# Altium schematic sheet SH05-DDS.SchDoc: ADM_PHASE_FPGA
size A4
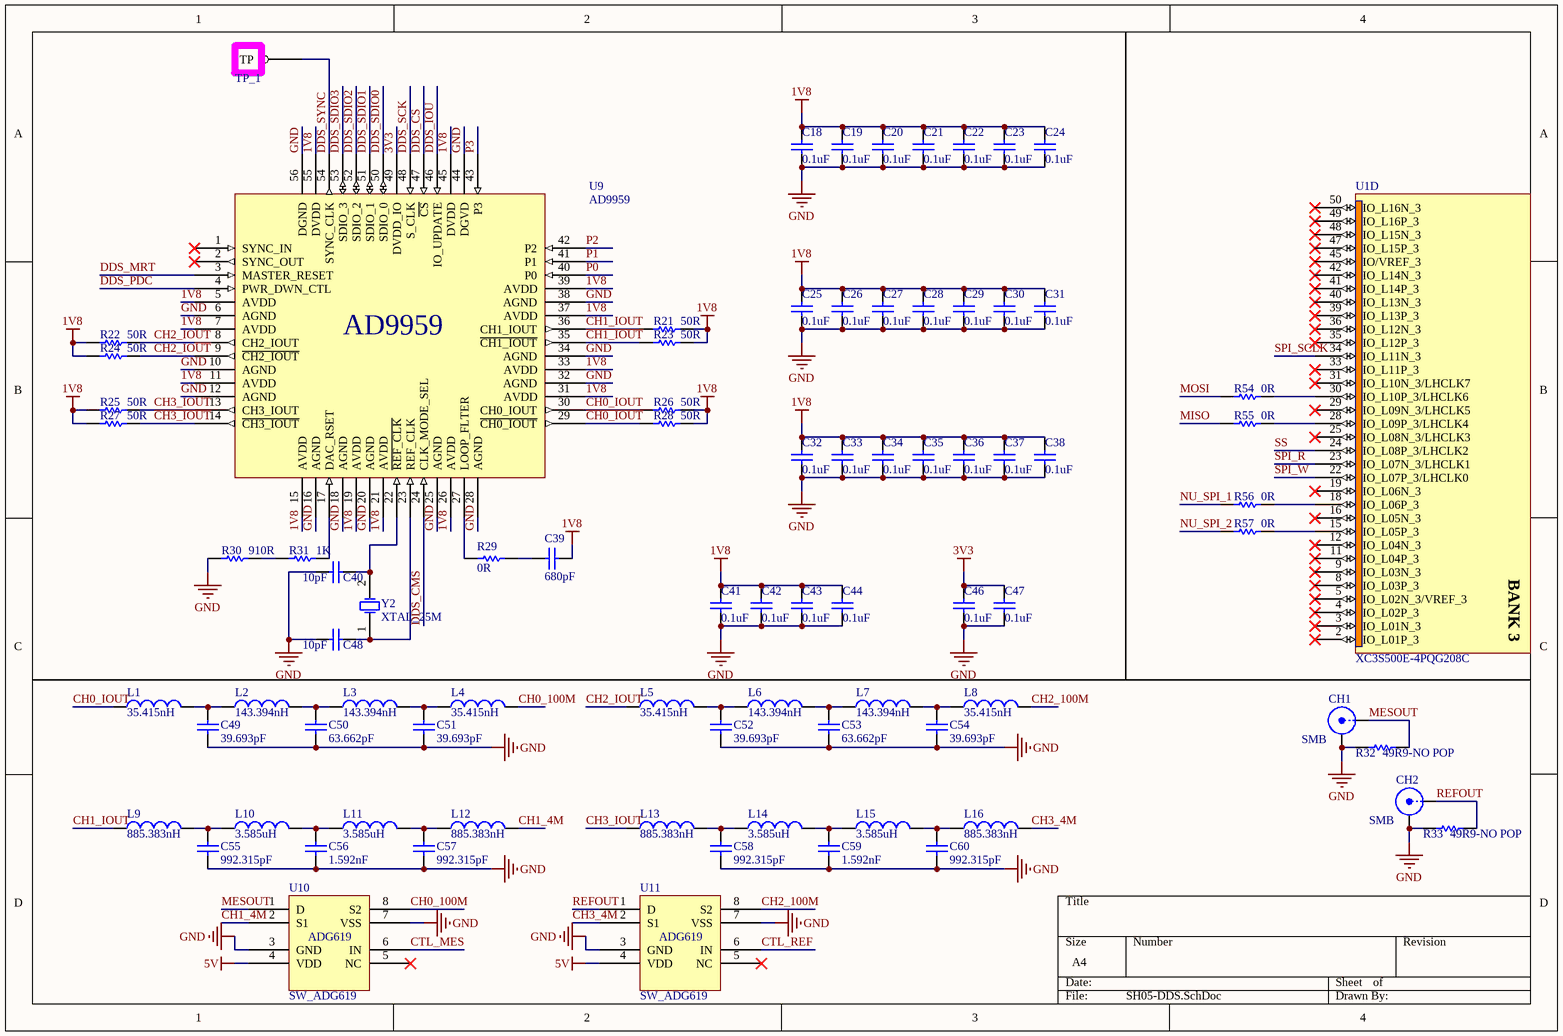
[diagram p0: SH05-DDS.SchDoc]

## Parts
C18  value 0.1uF  [1608[0603] - NoTopOverlay]  (hidden comment: Cap,0.1uF/0603)
C19  value 0.1uF  [1608[0603] - NoTopOverlay]  (hidden comment: Cap,0.1uF/0603)
C20  value 0.1uF  [1608[0603] - NoTopOverlay]  (hidden comment: Cap,0.1uF/0603)
C21  value 0.1uF  [1608[0603] - NoTopOverlay]  (hidden comment: Cap,0.1uF/0603)
C22  value 0.1uF  [1608[0603] - NoTopOverlay]  (hidden comment: Cap,0.1uF/0603)
C23  value 0.1uF  [1608[0603] - NoTopOverlay]  (hidden comment: Cap,0.1uF/0603)
C24  value 0.1uF  [1608[0603] - NoTopOverlay]  (hidden comment: Cap,0.1uF/0603)
C25  value 0.1uF  [1608[0603] - NoTopOverlay]  (hidden comment: Cap,0.1uF/0603)
C26  value 0.1uF  [1608[0603] - NoTopOverlay]  (hidden comment: Cap,0.1uF/0603)
C27  value 0.1uF  [1608[0603] - NoTopOverlay]  (hidden comment: Cap,0.1uF/0603)
C28  value 0.1uF  [1608[0603] - NoTopOverlay]  (hidden comment: Cap,0.1uF/0603)
C29  value 0.1uF  [1608[0603] - NoTopOverlay]  (hidden comment: Cap,0.1uF/0603)
C30  value 0.1uF  [1608[0603] - NoTopOverlay]  (hidden comment: Cap,0.1uF/0603)
C31  value 0.1uF  [1608[0603] - NoTopOverlay]  (hidden comment: Cap,0.1uF/0603)
C32  value 0.1uF  [1608[0603] - NoTopOverlay]  (hidden comment: Cap,0.1uF/0603)
C33  value 0.1uF  [1608[0603] - NoTopOverlay]  (hidden comment: Cap,0.1uF/0603)
C34  value 0.1uF  [1608[0603] - NoTopOverlay]  (hidden comment: Cap,0.1uF/0603)
C35  value 0.1uF  [1608[0603] - NoTopOverlay]  (hidden comment: Cap,0.1uF/0603)
C36  value 0.1uF  [1608[0603] - NoTopOverlay]  (hidden comment: Cap,0.1uF/0603)
C37  value 0.1uF  [1608[0603] - NoTopOverlay]  (hidden comment: Cap,0.1uF/0603)
C38  value 0.1uF  [1608[0603] - NoTopOverlay]  (hidden comment: Cap,0.1uF/0603)
C39  value 680pF  [1608[0603] - NoTopOverlay]  (hidden comment: Cap,680pF/0603)
C40  value 10pF  [1608[0603] - NoTopOverlay]  (hidden comment: Cap,10pF/0603)
C41  value 0.1uF  [1608[0603] - NoTopOverlay]  (hidden comment: Cap,0.1uF/0603)
C42  value 0.1uF  [1608[0603] - NoTopOverlay]  (hidden comment: Cap,0.1uF/0603)
C43  value 0.1uF  [1608[0603] - NoTopOverlay]  (hidden comment: Cap,0.1uF/0603)
C44  value 0.1uF  [1608[0603] - NoTopOverlay]  (hidden comment: Cap,0.1uF/0603)
C46  value 0.1uF  [1608[0603] - NoTopOverlay]  (hidden comment: Cap,0.1uF/0603)
C47  value 0.1uF  [1608[0603] - NoTopOverlay]  (hidden comment: Cap,0.1uF/0603)
C48  value 10pF  [1608[0603] - NoTopOverlay]  (hidden comment: Cap,10pF/0603)
C49  value 39.693pF  [1608[0603] - NoTopOverlay]  (hidden comment: Cap,39.693pF/0603)
C50  value 63.662pF  [1608[0603] - NoTopOverlay]  (hidden comment: Cap,63.662pF/0603)
C51  value 39.693pF  [1608[0603] - NoTopOverlay]  (hidden comment: Cap,39.693pF/0603)
C52  value 39.693pF  [1608[0603] - NoTopOverlay]  (hidden comment: Cap,39.693pF/0603)
C53  value 63.662pF  [1608[0603] - NoTopOverlay]  (hidden comment: Cap,63.662pF/0603)
C54  value 39.693pF  [1608[0603] - NoTopOverlay]  (hidden comment: Cap,39.693pF/0603)
C55  value 992.315pF  [1608[0603] - NoTopOverlay]  (hidden comment: Cap,992.315pF/0603)
C56  value 1.592nF  [1608[0603] - NoTopOverlay]  (hidden comment: Cap,1.592nF/0603)
C57  value 992.315pF  [1608[0603] - NoTopOverlay]  (hidden comment: Cap,992.315pF/0603)
C58  value 992.315pF  [1608[0603] - NoTopOverlay]  (hidden comment: Cap,992.315pF/0603)
C59  value 1.592nF  [1608[0603] - NoTopOverlay]  (hidden comment: Cap,1.592nF/0603)
C60  value 992.315pF  [1608[0603] - NoTopOverlay]  (hidden comment: Cap,992.315pF/0603)
CH1  SMB  [SMB_V-RJ45]
CH2  SMB  [SMB_V-RJ45]
L1  value 35.415nH  [2012[0805] - NoTopOverlay]  (hidden comment: Inductor,L0805,35.415nH)
L2  value 143.394nH  [2012[0805] - NoTopOverlay]  (hidden comment: Inductor,L0805,143.394nH)
L3  value 143.394nH  [2012[0805] - NoTopOverlay]  (hidden comment: Inductor,L0805,143.394nH)
L4  value 35.415nH  [2012[0805] - NoTopOverlay]  (hidden comment: Inductor,L0805,35.415nH)
L5  value 35.415nH  [2012[0805] - NoTopOverlay]  (hidden comment: Inductor,L0805,35.415nH)
L6  value 143.394nH  [2012[0805] - NoTopOverlay]  (hidden comment: Inductor,L0805,143.394nH)
L7  value 143.394nH  [2012[0805] - NoTopOverlay]  (hidden comment: Inductor,L0805,143.394nH)
L8  value 35.415nH  [2012[0805] - NoTopOverlay]  (hidden comment: Inductor,L0805,35.415nH)
L9  value 885.383nH  [2012[0805] - NoTopOverlay]  (hidden comment: Inductor,L0805,885.383nH)
L10  value 3.585uH  [2012[0805] - NoTopOverlay]  (hidden comment: Inductor,L0805,3.585uH)
L11  value 3.585uH  [2012[0805] - NoTopOverlay]  (hidden comment: Inductor,L0805,3.585uH)
L12  value 885.383nH  [2012[0805] - NoTopOverlay]  (hidden comment: Inductor,L0805,885.383nH)
L13  value 885.383nH  [2012[0805] - NoTopOverlay]  (hidden comment: Inductor,L0805,885.383nH)
L14  value 3.585uH  [2012[0805] - NoTopOverlay]  (hidden comment: Inductor,L0805,3.585uH)
L15  value 3.585uH  [2012[0805] - NoTopOverlay]  (hidden comment: Inductor,L0805,3.585uH)
L16  value 885.383nH  [2012[0805] - NoTopOverlay]  (hidden comment: Inductor,L0805,885.383nH)
R21  value 50R  [1608[0603] - NoTopOverlay]  (hidden comment: Res,50R/0603)
R22  value 50R  [1608[0603] - NoTopOverlay]  (hidden comment: Res,50R/0603)
R23  value 50R  [1608[0603] - NoTopOverlay]  (hidden comment: Res,50R/0603)
R24  value 50R  [1608[0603] - NoTopOverlay]  (hidden comment: Res,50R/0603)
R25  value 50R  [1608[0603] - NoTopOverlay]  (hidden comment: Res,50R/0603)
R26  value 50R  [1608[0603] - NoTopOverlay]  (hidden comment: Res,50R/0603)
R27  value 50R  [1608[0603] - NoTopOverlay]  (hidden comment: Res,50R/0603)
R28  value 50R  [1608[0603] - NoTopOverlay]  (hidden comment: Res,50R/0603)
R29  value 0R  [1608[0603] - NoTopOverlay]  (hidden comment: Res,0R/0603)
R30  value 910R  [1608[0603] - NoTopOverlay]  (hidden comment: Res,910R/0603)
R31  value 1K  [1608[0603] - NoTopOverlay]  (hidden comment: Res,1K/0805)
R32  value 49R9-NO POP  [1608[0603] - NoTopOverlay]  (hidden comment: Res,49R9/0603)
R33  value 49R9-NO POP  [1608[0603] - NoTopOverlay]  (hidden comment: Res,49R9/0603)
R54  value 0R  [1608[0603] - NoTopOverlay]  (hidden comment: Res,0R/0603)
R55  value 0R  [1608[0603] - NoTopOverlay]  (hidden comment: Res,0R/0603)
R56  value 0R  [1608[0603] - NoTopOverlay]  (hidden comment: Res,0R/0603)
R57  value 0R  [1608[0603] - NoTopOverlay]  (hidden comment: Res,0R/0603)
TP_1  TP_DDS_SYNC_CLK  [MYTP]  (value not drawn)
U1  XC3S500E-4PQG208C  [PQG208_N]  (part D of 8)
U9  AD9959  [CP-56]
U10  SW_ADG619  [SOT23D]
U11  SW_ADG619  [SOT23D]
Y2  XTAL_25M  [XTAL2]

## Nets
1V8: C18.1 C19.1 C20.1 C21.1 C22.1 C23.1 C24.1 C25.1 C26.1 C27.1 C28.1 C29.1 C30.1 C31.1 C32.1 C33.1 C34.1 C35.1 C36.1 C37.1 C38.1 C39.1 C41.1 C42.1 C43.1 C44.1 R21.2 R22.1 R23.2 R24.1 R25.1 R26.2 R27.1 R28.2 U9.5(AVDD) U9.7(AVDD) U9.11(AVDD) U9.15(AVDD) U9.19(AVDD) U9.21(AVDD) U9.26(AVDD) U9.31(AVDD) U9.33(AVDD) U9.37(AVDD) U9.39(AVDD) U9.45(DVDD) U9.55(DVDD)
3V3: C46.1 C47.1 U9.49(DVDD_IO)
5V: U10.4(VDD) U11.4(VDD)
GND: C18.2 C19.2 C20.2 C21.2 C22.2 C23.2 C24.2 C25.2 C26.2 C27.2 C28.2 C29.2 C30.2 C31.2 C32.2 C33.2 C34.2 C35.2 C36.2 C37.2 C38.2 C40.1 C41.2 C42.2 C43.2 C44.2 C46.2 C47.2 C48.2 C49.2 C50.2 C51.2 C52.2 C53.2 C54.2 C55.2 C56.2 C57.2 C58.2 C59.2 C60.2 CH1.2(Y) CH2.2(Y) R30.2 R32.2 R33.2 U9.6(AGND) U9.10(AGND) U9.12(AGND) U9.16(AGND) U9.18(AGND) U9.20(AGND) U9.25(AGND) U9.28(AGND) U9.32(AGND) U9.34(AGND) U9.38(AGND) U9.44(DGVD) U9.56(DGND) U10.3(GND) U10.7(VSS) U11.3(GND) U11.7(VSS)
~{CH0_IOUT}: R28.1 U9.29(~{CH0_IOUT})
~{CH1_IOUT}: R23.1 U9.35(~{CH1_IOUT})
~{CH2_IOUT}: R24.2 U9.9(~{CH2_IOUT})
~{CH3_IOUT}: R27.2 U9.14(~{CH3_IOUT})
CH0_100M: L4.2 U10.8(S2)
CH0_IOUT: L1.1 R26.1 U9.30(CH0_IOUT)
CH1_4M: L12.2 U10.2(S1)
CH1_IOUT: L9.1 R21.1 U9.36(CH1_IOUT)
CH2_100M: L8.2 U11.8(S2)
CH2_IOUT: L5.1 R22.2 U9.8(CH2_IOUT)
CH3_4M: L16.2 U11.2(S1)
CH3_IOUT: L13.1 R25.2 U9.13(CH3_IOUT)
CTL_MES: U10.6(IN)
CTL_REF: U11.6(IN)
DDS~{_CS}: U9.47(~{CS})
DDS_CMS: U9.24(CLK_MODE_SEL)
DDS_IOU: U9.46(IO_UPDATE)
DDS_MRT: U9.3(MASTER_RESET)
DDS_PDC: U9.4(PWR_DWN_CTL)
DDS_SCK: U9.48(S_CLK)
DDS_SDIO0: U9.50(SDIO_0)
DDS_SDIO1: U9.51(SDIO_1)
DDS_SDIO2: U9.52(SDIO_2)
DDS_SDIO3: U9.53(SDIO_3)
DDS_SYNC: TP_1.1(TP) U9.54(SYNC_CLK)
MESOUT: CH1.1(X) R32.1 U10.1(D)
MISO: R55.2
MOSI: R54.2
NU_SPI_1: R56.2
NU_SPI_2: R57.2
P0: U9.40(P0)
P1: U9.41(P1)
P2: U9.42(P2)
P3: U9.43(P3)
REFOUT: CH2.1(X) R33.1 U11.1(D)
SPI_R: U1.23(IO_L07N_3/LHCLK1)
SPI_SCLK: U1.34(IO_L11N_3)
SPI_W: U1.22(IO_L07P_3/LHCLK0)
SS: U1.24(IO_L08P_3/LHCLK2)
NetC39_2: C39.2 R29.1
NetC40_2: C40.2 U9.22(~{REF_CLK}) Y2.2(OSC2)
NetC48_1: C48.1 U9.23(REF_CLK) Y2.1(OSC1)
NetC49_1: C49.1 L1.2 L2.1
NetC50_1: C50.1 L2.2 L3.1
NetC51_1: C51.1 L3.2 L4.1
NetC52_1: C52.1 L5.2 L6.1
NetC53_1: C53.1 L6.2 L7.1
NetC54_1: C54.1 L7.2 L8.1
NetC55_1: C55.1 L9.2 L10.1
NetC56_1: C56.1 L10.2 L11.1
NetC57_1: C57.1 L11.2 L12.1
NetC58_1: C58.1 L13.2 L14.1
NetC59_1: C59.1 L14.2 L15.1
NetC60_1: C60.1 L15.2 L16.1
NetR29_2: R29.2 U9.27(LOOP_FLTER)
NetR30_1: R30.1 R31.2
NetR31_1: R31.1 U9.17(DAC_RSET)
NetR54_1: R54.1 U1.30(IO_L10P_3/LHCLK6)
NetR55_1: R55.1 U1.28(IO_L09P_3/LHCLK4)
NetR56_1: R56.1 U1.18(IO_L06P_3)
NetR57_1: R57.1 U1.15(IO_L05P_3)

Not connected (* = marked no-connect by the designer): U1 2(IO_L01P_3)* 3(IO_L01N_3)* 4(IO_L02P_3)* 5(IO_L02N_3/VREF_3)* 8(IO_L03P_3)* 9(IO_L03N_3)* 11(IO_L04P_3)* 12(IO_L04N_3)* 16(IO_L05N_3)* 19(IO_L06N_3)* 25(IO_L08N_3/LHCLK3)* 29(IO_L09N_3/LHCLK5)* 31(IO_L10N_3/LHCLK7)* 33(IO_L11P_3)* 35(IO_L12P_3)* 36(IO_L12N_3)* 39(IO_L13P_3)* 40(IO_L13N_3)* 41(IO_L14P_3)* 42(IO_L14N_3)* 45(IO/VREF_3)* 47(IO_L15P_3)* 48(IO_L15N_3)* 49(IO_L16P_3)* 50(IO_L16N_3)*; U9 1(SYNC_IN)* 2(SYNC_OUT)*; U10 5(NC)*; U11 5(NC)*

## Notes on the sheet
- (in symbol SW_ADG619) ADG619
- (in symbol XC3S500E-4PQG208C, part D) BANK 3

## Library data of the parts
C18-C44 C46-C60 = Cap: Capacitor; Published: 8-Jun-2000; LatestRevisionDate: 17-Jul-2002; LatestRevisionNote: Re-released for DXP Platform.; PackageReference: RAD-0.3; Publisher: Altium Limited
CH1 CH2 = SMB: SMB Straight Connector; LatestRevisionDate: 17-Jul-2002; LatestRevisionNote: Re-released for DXP Platform.; Publisher: Altium Limited
L1-L16 = Inductor: Code_IEC: 1005; Published: 8-Jun-2000; LatestRevisionDate: 17-Jul-2002; LatestRevisionNote: Re-released for DXP Platform.; PackageReference: 0402-A; Publisher: Altium Limited; Code_JEITA: 0402
R21-R33 R54-R57 = Res1: Resistor; Published: 8-Jun-2000; LatestRevisionDate: 17-Jul-2002; LatestRevisionNote: Re-released for DXP Platform.; PackageReference: AXIAL-0.3; Publisher: Altium Limited
TP_1 = TEST POINT_0: Right: 10; Bottom: 20
U1 = XC3S500E-4PQG208C: Spartan-3E 1.2V FPGA, 158 User I/Os, 208-Pin Pb-Free PQFP, Standard Performance, Commercial Grade; Published: 6-Jun-2005; LatestRevisionDate: 13-Apr-2006; LatestRevisionNote: IPC-7351 Footprint Added.; DatasheetVersion: 16-Mar-2007; PackageVersion: ver1.2, Jun-2004; PackageReference: PQG208; Publisher: Altium Limited; PackageDescription: 208-Pin Plastic Quad Flat Pack (PQG208) - Pb-Free; Code_JEDEC: MS-029-FA-1; ComponentLink1Description: Manufacturer Link; ComponentLink1URL: http://www.xilinx.com/products/silicon_solutions/fpgas/spartan_series/spartan3e_fpgas/index.htm; ComponentLink2Description: Datasheet; ComponentLink2URL: http://direct.xilinx.com/bvdocs/publications/ds312.pdf
U9 = DDS_AD9959
U10 U11 = SW_ADG619: Single SPDT Switches
Y2 = XTAL: Crystal Oscillator; Published: 8-Jun-2000; LatestRevisionDate: 17-Jul-2002; LatestRevisionNote: Re-released for DXP Platform.; PackageReference: R38; Publisher: Altium Limited